# Altium schematic sheet X7A15T-Decoupling.SchDoc: PCB-Relay-Board X7A15T-Decoupling
size A4 portrait; Address1: Hans-Bunte-Strasse 19; Address2: D-79108 Freiburg; Address3: Germany; DocumentNumber: U33111; Revision: V1.0; SheetNumber: 6; SheetTotal: 7; Date: JUN 2020; CheckedBy: Moerz, Hoeren; Author: Rudziński; CompanyName: TDK-Micronas GmbH; DrawnBy: Rudziński; Engineer: Rudziński; DateDraw: JUN 2020; DateChecked: 2020-06-19; PageSetup: Record=PageOptions|CenterHorizontal=True|CenterVertical=True|PrintScale=0.97|XCorrection=1.00|YCorrection=1.00|PrintKind=0|BorderSize=5000000|LeftOffset=0|BottomOffset=0|Orientation=2|PaperLength=1000|PaperWidth=1000|Scale=100|PaperSource=7|PrintQuality=-3|MediaType=1|DitherType=10|PrintScaleMode=1|PaperKind=A4|PaperIndex=9; TitleTyp: Title-Typ; Block: CPU & SCT8; Workspace: Workspace
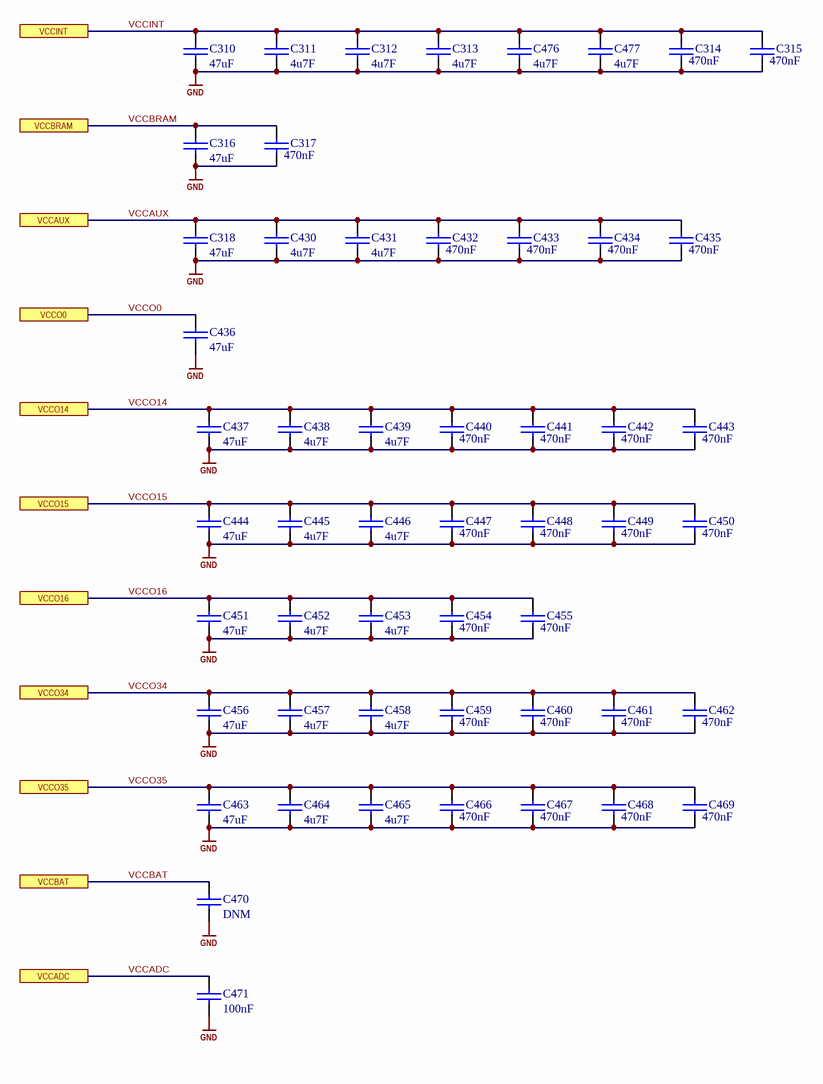
[diagram p0: X7A15T-Decoupling.SchDoc]

## Parts
C310  value 47uF  [C0805 Reflow]  (hidden comment: C)
C311  value 4u7F  [C0402 Reflow]  (hidden comment: C)
C312  value 4u7F  [C0402 Reflow]  (hidden comment: C)
C313  value 4u7F  [C0402 Reflow]  (hidden comment: C)
C314  value 470nF  [C0402 Reflow]  (hidden comment: C)
C315  value 470nF  [C0402 Reflow]  (hidden comment: C)
C316  value 47uF  [C0805 Reflow]  (hidden comment: C)
C317  value 470nF  [C0402 Reflow]  (hidden comment: C)
C318  value 47uF  [C0805 Reflow]  (hidden comment: C)
C430  value 4u7F  [C0402 Reflow]  (hidden comment: C)
C431  value 4u7F  [C0402 Reflow]  (hidden comment: C)
C432  value 470nF  [C0402 Reflow]  (hidden comment: C)
C433  value 470nF  [C0402 Reflow]  (hidden comment: C)
C434  value 470nF  [C0402 Reflow]  (hidden comment: C)
C435  value 470nF  [C0402 Reflow]  (hidden comment: C)
C436  value 47uF  [C0805 Reflow]  (hidden comment: C)
C437  value 47uF  [C0805 Reflow]  (hidden comment: C)
C438  value 4u7F  [C0402 Reflow]  (hidden comment: C)
C439  value 4u7F  [C0402 Reflow]  (hidden comment: C)
C440  value 470nF  [C0402 Reflow]  (hidden comment: C)
C441  value 470nF  [C0402 Reflow]  (hidden comment: C)
C442  value 470nF  [C0402 Reflow]  (hidden comment: C)
C443  value 470nF  [C0402 Reflow]  (hidden comment: C)
C444  value 47uF  [C0805 Reflow]  (hidden comment: C)
C445  value 4u7F  [C0402 Reflow]  (hidden comment: C)
C446  value 4u7F  [C0402 Reflow]  (hidden comment: C)
C447  value 470nF  [C0402 Reflow]  (hidden comment: C)
C448  value 470nF  [C0402 Reflow]  (hidden comment: C)
C449  value 470nF  [C0402 Reflow]  (hidden comment: C)
C450  value 470nF  [C0402 Reflow]  (hidden comment: C)
C451  value 47uF  [C0805 Reflow]  (hidden comment: C)
C452  value 4u7F  [C0402 Reflow]  (hidden comment: C)
C453  value 4u7F  [C0402 Reflow]  (hidden comment: C)
C454  value 470nF  [C0402 Reflow]  (hidden comment: C)
C455  value 470nF  [C0402 Reflow]  (hidden comment: C)
C456  value 47uF  [C0805 Reflow]  (hidden comment: C)
C457  value 4u7F  [C0402 Reflow]  (hidden comment: C)
C458  value 4u7F  [C0402 Reflow]  (hidden comment: C)
C459  value 470nF  [C0402 Reflow]  (hidden comment: C)
C460  value 470nF  [C0402 Reflow]  (hidden comment: C)
C461  value 470nF  [C0402 Reflow]  (hidden comment: C)
C462  value 470nF  [C0402 Reflow]  (hidden comment: C)
C463  value 47uF  [C0805 Reflow]  (hidden comment: C)
C464  value 4u7F  [C0402 Reflow]  (hidden comment: C)
C465  value 4u7F  [C0402 Reflow]  (hidden comment: C)
C466  value 470nF  [C0402 Reflow]  (hidden comment: C)
C467  value 470nF  [C0402 Reflow]  (hidden comment: C)
C468  value 470nF  [C0402 Reflow]  (hidden comment: C)
C469  value 470nF  [C0402 Reflow]  (hidden comment: C)
C470  value DNM  [C0402 Reflow]  (hidden comment: C)  (no BOM)
C471  value 100nF  [C0402 Reflow]  (hidden comment: C)
C476  value 4u7F  [C0402 Reflow]  (hidden comment: C)
C477  value 4u7F  [C0402 Reflow]  (hidden comment: C)

## Ports
VCCADC, VCCAUX, VCCBAT, VCCBRAM, VCCINT, VCCO0, VCCO14, VCCO15, VCCO16, VCCO34, VCCO35

## Nets
GND: C310.2 C311.2 C312.2 C313.2 C314.2 C315.2 C316.2 C317.2 C318.2 C430.2 C431.2 C432.2 C433.2 C434.2 C435.2 C436.2 C437.2 C438.2 C439.2 C440.2 C441.2 C442.2 C443.2 C444.2 C445.2 C446.2 C447.2 C448.2 C449.2 C450.2 C451.2 C452.2 C453.2 C454.2 C455.2 C456.2 C457.2 C458.2 C459.2 C460.2 C461.2 C462.2 C463.2 C464.2 C465.2 C466.2 C467.2 C468.2 C469.2 C470.2 C471.2 C476.2 C477.2
VCCADC: C471.1 ; port VCCADC
VCCAUX: C318.1 C430.1 C431.1 C432.1 C433.1 C434.1 C435.1 ; port VCCAUX
VCCBAT: C470.1 ; port VCCBAT
VCCBRAM: C316.1 C317.1 ; port VCCBRAM
VCCINT: C310.1 C311.1 C312.1 C313.1 C314.1 C315.1 C476.1 C477.1 ; port VCCINT
VCCO0: C436.1 ; port VCCO0
VCCO14: C437.1 C438.1 C439.1 C440.1 C441.1 C442.1 C443.1 ; port VCCO14
VCCO15: C444.1 C445.1 C446.1 C447.1 C448.1 C449.1 C450.1 ; port VCCO15
VCCO16: C451.1 C452.1 C453.1 C454.1 C455.1 ; port VCCO16
VCCO34: C456.1 C457.1 C458.1 C459.1 C460.1 C461.1 C462.1 ; port VCCO34
VCCO35: C463.1 C464.1 C465.1 C466.1 C467.1 C468.1 C469.1 ; port VCCO35

## Notes on the sheet
- designed by
- reviewed by
- last drawn by
- Project:
- Schematic:
- last printed
- DIN-A4 P
- sheets
- of
- File:

## Library data of the parts
C310 C316 C318 C436 C437 C444 C451 C456 C463 = CAP: CAP CER 47UF 10V X5R 0805; MFR-PN: GRM32ER71A476KE15L; MFR: MURATA; MFR-TYPE: GRM series; 04. Manufacturer: Murata Electronics North America; 07. Manufacturer  Part Number: GRM21BR61A476ME15L; POPULATED: yes; Parameters: X7R, 10V, 10%; 03. Unit Price: 0.67; Tolerance: ±20%; Type: X7R; 3D-Export: No; Temperature Range: -55°C ~ 85°C; 01. Distributor: DigiKey; 02. Distributor Part Number: 490-9961-6-ND; 09. Operating Temperature: -55°C ~ 85°C; 11. RoHS: YES; Voltage Rating: 10V; ComponentLink4Description: Info; ComponentLink4URL: https://www.digikey.de/product-detail/en/murata-electronics-north-america/GRM21BR61A476ME15L/490-9961-6-ND/5027050; ComponentLink5Description: DataSheet; ComponentLink5URL: https://search.murata.co.jp/Ceramy/image/img/A01X/G101/ENG/GRM21BR61A476ME15-01.pdf
C311-C313 C430 C431 C438 C439 C445 C446 C452 C453 C457 C458 C464 C465 C470 C476 C477 = CAP: CAP CER 4.7UF 6.3V X5R 0402; 04. Manufacturer: Samsung Electro-Mechanics; 07. Manufacturer  Part Number: CL05A475KQ5NRNC; POPULATED: yes; Parameters: X7R, 6V3, 10%; 03. Unit Price: 0.28; Tolerance: 10%; Type: X7R; Voltage Rating: 6V3; 3D-Export: No; Temperature Range: -40°C/+85°C; 01. Distributor: DigiKey; 02. Distributor Part Number: 1276-1481-6-ND; 09. Operating Temperature: -55°C ~ 85°C; 11. RoHS: YES; ComponentLink4Description: DataSheet; ComponentLink4URL: https://media.digikey.com/pdf/Data%20Sheets/Samsung%20PDFs/CL_Series_MLCC_ds.pdf; ComponentLink5Description: Info; ComponentLink5URL: https://www.digikey.de/product-detail/en/samsung-electro-mechanics/CL05A475KQ5NRNC/1276-1481-6-ND/3891995
C314 C315 C317 C432-C435 C440-C443 C447-C450 C454 C455 C459-C462 C466-C469 = CAP: CAP CER 0.47UF 10V X5R 0402; 04. Manufacturer: Samsung Electro-Mechanics; 07. Manufacturer  Part Number: CL05A474KP5NNNC; POPULATED: yes; Parameters: X5R, 10V, 10%; 03. Unit Price: 0.09; Tolerance: 10%; 3D-Export: No; Temperature Range: -55°C ~ 85°C; 01. Distributor: DigiKey; 02. Distributor Part Number: 1276-1173-6-ND; 09. Operating Temperature: -55°C ~ 85°C; 11. RoHS: YES; Type: X5R; Voltage Rating: 10V; ComponentLink4Description: Info; ComponentLink4URL: https://www.digikey.de/product-detail/en/samsung-electro-mechanics/CL05A474KP5NNNC/1276-1173-6-ND/3891687; ComponentLink5Description: DataSheet; ComponentLink5URL: https://media.digikey.com/pdf/Data%20Sheets/Samsung%20PDFs/CL_Series_MLCC_ds.pdf
C471 = CAP: CAP CER 0.1UF 25V X7R 0402; 04. Manufacturer: Yageo; 07. Manufacturer  Part Number: CC0402KRX7R8BB104; POPULATED: yes; Parameters: X7R, 6V3, 10%; 03. Unit Price: 0.09; Tolerance: 10%; Voltage Rating: 6V3; 3D-Export: No; Temperature Range: -40°C/+85°C; 01. Distributor: DigiKey; 02. Distributor Part Number: 311-2077-6-ND; 09. Operating Temperature: -55°C ~ 85°C; 11. RoHS: YES; Type: X7R; ComponentLink4Description: DataSheet; ComponentLink4URL: https://media.digikey.com/pdf/Data%20Sheets/Samsung%20PDFs/CL_Series_MLCC_ds.pdf; ComponentLink5Description: Info; ComponentLink5URL: https://www.digikey.de/product-detail/en/samsung-electro-mechanics/CL05A475KQ5NRNC/1276-1481-6-ND/3891995